# EAGLE design audioRev5 (EAGLE 9.7.0)
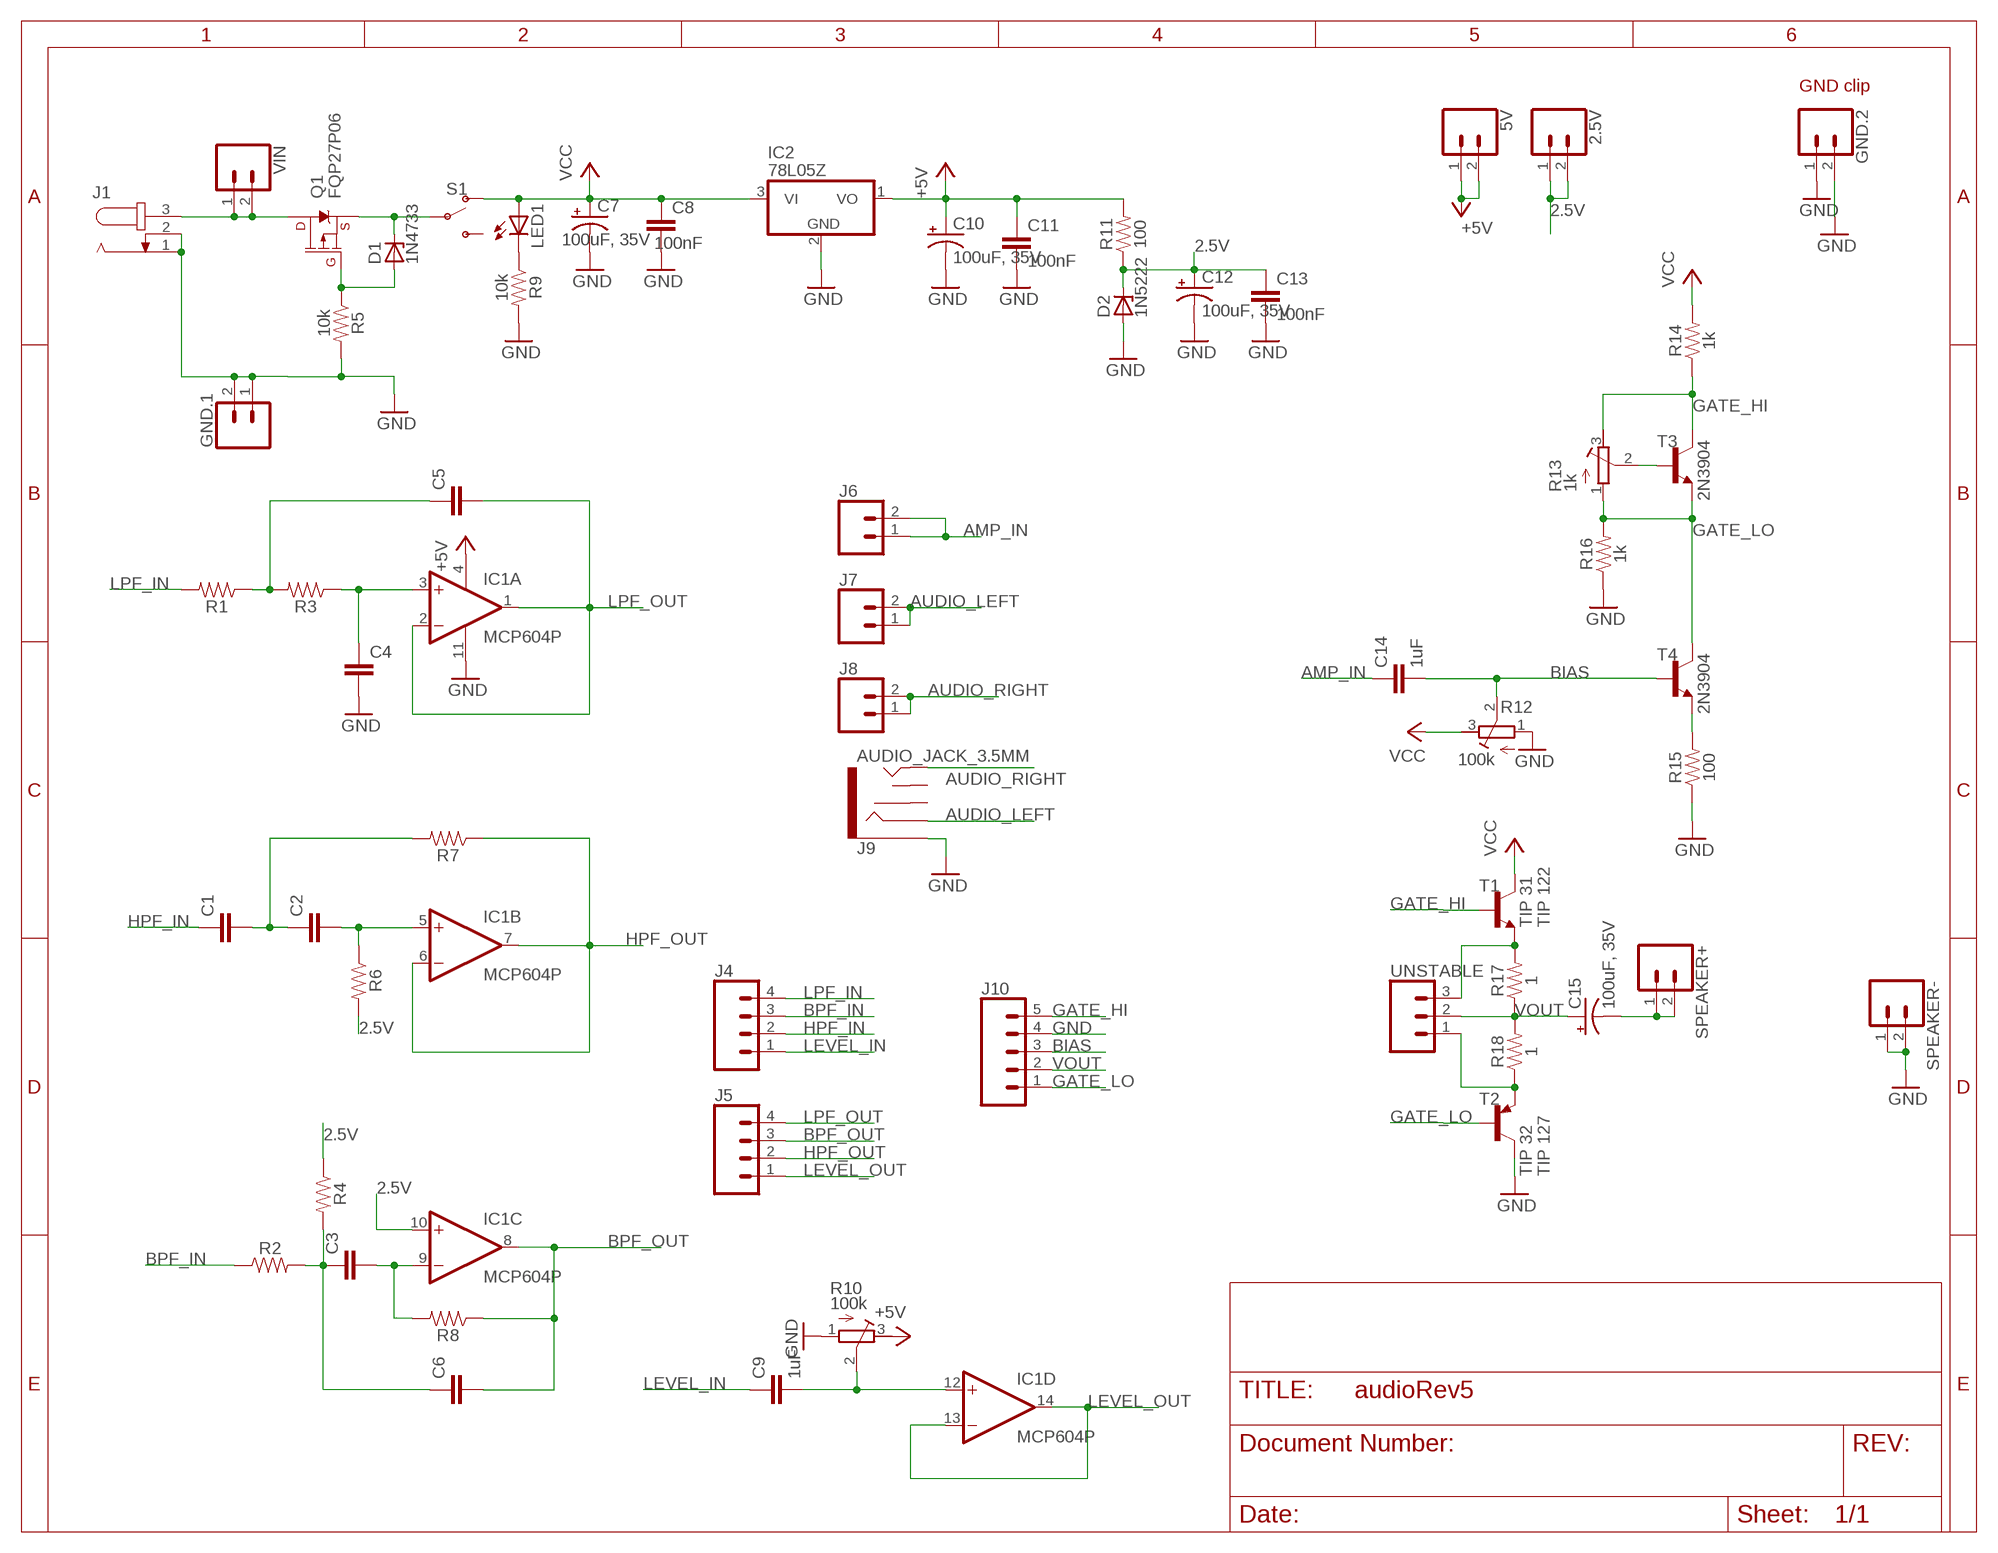
[diagram p0: schematic, sheet 1]

## Parts
2.5V  CONN_02  [1X02]
5V  CONN_02  [1X02]
C1  C-EU025-025X050  [C025-025X050]
C2  C-EU025-025X050  [C025-025X050]
C3  C-EU025-025X050  [C025-025X050]
C4  C-EU025-025X050  [C025-025X050]
C5  C-EU025-025X050  [C025-025X050]
C6  C-EU025-025X050  [C025-025X050]
C7  100uF, 35V  CPOL-USE2.5-6  [E2,5-6]
C8  100nF  C-EU025-025X050  [C025-025X050]
C9  1uF  C-EU025-025X050  [C025-025X050]
C10  100uF, 35V  CPOL-USE2.5-6  [E2,5-6]
C11  100nF  C-EU025-025X050  [C025-025X050]
C12  100uF, 35V  CPOL-USE2.5-6  [E2,5-6]
C13  100nF  C-EU025-025X050  [C025-025X050]
C14  1uF  C-EU025-025X050  [C025-025X050]
C15  100uF, 35V  CPOL-USE2.5-6  [E2,5-6]
D1  1N4733  ZENER-DIODEDO41Z10  [DO41Z10]
D2  1N5222  ZENER-DIODEDO34-7  [DO34Z7]
GND.1  CONN_02  [1X02]
GND.2  CONN_02  [1X02]
IC1  MCP604P  [DIL14]
IC2  78L05Z  [TO92]
J1  JACK-PLUG0  [SPC4077]
J4  CONN_04LOCK_LONGPADS  [1X04_LOCK_LONGPADS]
J5  CONN_04LOCK_LONGPADS  [1X04_LOCK_LONGPADS]
J6  CONN_02  [1X02]
J7  CONN_02  [1X02]
J8  CONN_02  [1X02]
J9  AUDIO_JACK_3.5MM  AUDIO_JACK_3.5MM_PTH  [AUDIO-JACK]
J10  CONN_05PTH_LONGPADS  [1X05_LONGPADS]
LED1  LED5MM  [LED5MM]
Q1  FQP27P06  MOSFET_PCH-NDP6020P  [TO220V]
R1  RESISTORAXIAL-0.3  [AXIAL-0.3]
R2  RESISTORAXIAL-0.3  [AXIAL-0.3]
R3  RESISTORAXIAL-0.3  [AXIAL-0.3]
R4  RESISTORAXIAL-0.3  [AXIAL-0.3]
R5  10k  RESISTORAXIAL-0.3  [AXIAL-0.3]
R6  RESISTORAXIAL-0.3  [AXIAL-0.3]
R7  RESISTORAXIAL-0.3  [AXIAL-0.3]
R8  RESISTORAXIAL-0.3  [AXIAL-0.3]
R9  10k  RESISTORAXIAL-0.3  [AXIAL-0.3]
R10  100k  R-TRIMM3296W  [RTRIM3296W]
R11  100  RESISTORAXIAL-0.3  [AXIAL-0.3]
R12  100k  R-TRIMM3296W  [RTRIM3296W]
R13  1k  R-TRIMM3296W  [RTRIM3296W]
R14  1k  RESISTORAXIAL-0.3  [AXIAL-0.3]
R15  100  RESISTORAXIAL-0.3  [AXIAL-0.3]
R16  1k  RESISTORAXIAL-0.3  [AXIAL-0.3]
R17  1  RESISTORAXIAL-0.3  [AXIAL-0.3]
R18  1  RESISTORAXIAL-0.3  [AXIAL-0.3]
S1  SWITCH-SPDT-PTH-11.6X4.0MM  [SWITCH_SPDT_PTH_11.6X4.0MM]
SPEAKER+  CONN_02  [1X02]
SPEAKER-  CONN_02  [1X02]
T1  TIP 31  -NPN-TO220V  [TO220V]
T2  TIP 32  -PNP-TO220V  [TO220V]
T3  2N3904  -NPN-TO92-EBC  [TO92-EBC]
T4  2N3904  -NPN-TO92-EBC  [TO92-EBC]
UNSTABLE  CONN_03LOCK_LONGPADS  [1X03_LOCK_LONGPADS]
VIN  CONN_02  [1X02]

## Nets
2.5V: 2.5V.1 2.5V.2 C12.+ C13.1 D2.C IC1.10(C:+IN) R4.P$1 R6.P$2 R11.P$1
+5V: 5V.1 5V.2 C10.+ C11.1 IC1.4(P:V+) IC2.1(VO) R10.3(E) R11.P$2
AMP_IN: C14.1 J6.1 J6.2
AUDIO_LEFT: J7.1 J7.2 J9.RING
AUDIO_RIGHT: J8.1 J8.2 J9.TIP
BIAS: C14.2 J10.3 R12.2(S) T4.B
BPF_IN: J4.3 R2.P$1
BPF_OUT: C6.2 IC1.8(C:OUT) J5.3 R8.P$1
DRAIN: J1.3 Q1.2(D) VIN.1 VIN.2
GATE: D1.A Q1.1(G) R5.P$1
GATE_HI: J10.5 R13.3(E) R14.P$1 T1.1(B) T3.C
GATE_LO: J10.1 R13.1(A) R16.P$2 T2.1(B) T3.E T4.C
GND: C4.2 C7.- C8.2 C10.- C11.2 C12.- C13.2 D2.A GND.1.1 GND.1.2 GND.2.1 GND.2.2 IC1.11(P:V-) IC2.2(GND) J1.1 J1.2 J9.SLEEVE J10.4 R5.P$2 R9.P$2 R10.1(A) R12.1(A) R15.P$1 R16.P$1 SPEAKER-.1 SPEAKER-.2 T2.2(C)
HPF_IN: C1.1 J4.2
HPF_OUT: IC1.6(B:-IN) IC1.7(B:OUT) J5.2 R7.P$1
LEVEL_IN: C9.1 J4.1
LEVEL_OUT: IC1.13(D:-IN) IC1.14(D:OUT) J5.1
LPF_IN: J4.4 R1.P$2
LPF_OUT: C5.2 IC1.1(A:OUT) IC1.2(A:-IN) J5.4
N$1: R18.P$1 T2.3(E) UNSTABLE.1
N$2: R17.P$2 T1.3(E) UNSTABLE.3
N$3: R15.P$2 T4.E
N$6: C3.1 C6.1 R2.P$2 R4.P$2
N$9: C4.1 IC1.3(A:+IN) R3.P$1
N$10: C5.1 R1.P$1 R3.P$2
N$11: C3.2 IC1.9(C:-IN) R8.P$2
N$12: C2.2 IC1.5(B:+IN) R6.P$1
N$13: C1.2 C2.1 R7.P$2
N$14: C9.2 IC1.12(D:+IN) R10.2(S)
N$16: C15.- SPEAKER+.1 SPEAKER+.2
N$18: LED1.K(C) R9.P$1
N$19: R13.2(S) T3.B
SOURCE: D1.C Q1.3(S) S1.2(P)
VCC: C7.+ C8.1 IC2.3(VI) LED1.A R12.3(E) R14.P$2 S1.1(O) T1.2(C)
VOUT: C15.+ J10.2 R17.P$1 R18.P$2 UNSTABLE.2
Unconnected: J9.RSH J9.TSH S1.3(S)

## Notes on the sheet
- GND clip
- TIP 122
- TIP 127

## Library data of the parts
2.5V 5V GND.1 GND.2 J6-J8 SPEAKER+ SPEAKER- VIN = SparkFun-Connectors:CONN_02: Multi connection point. Often used as Generic Header-pin footprint for 0.1 inch spaced/style header connections On any of the 0.1 inch spaced packages, you can populate with these: Break Away Headers - Straight <https://www.sparkfun.com/products/116> (PRT-00116) Break Away Male Headers - Right Angle <https://www.sparkfun.com/products/553> (PRT-00553) Female Headers <https://www.sparkfun.com/products/115> (PRT-00115) Break Away Headers - Machine Pin <https://www.sparkfun.com/products/117> (PRT-00117) Break Away Female Headers - Swiss Machine Pin <https://www.sparkfun.com/products/743> (PRT-00743) For SCREWTERMINALS and SPRING TERMINALS visit here: Screw Terimnals on SparkFun.com <https://www.sparkfun.com/search/results?term=Screw+Terminals> (5mm/3.5mm/2.54mm spacing) This device is also useful as a general connection point to wire up your design to another part of your project. Our various solder wires solder well into these plated through hole pads. Hook-Up Wire - Assortment (Stranded, 22 AWG) <https://www.sparkfun.com/products/11375> (PRT-11375) Hook-Up Wire - Assortment (Solid Core, 22 AWG) <https://www.sparkfun.com/products/11367> (PRT-11367) View the entire wire category on our website here <https://www.sparkfun.com/categories/141> Special notes: Molex polarized connector foot print use with: PRT-08233 with associated crimp pins and housings. 2.54_SCREWTERM for use with PRT-10571. 3.5mm Screw Terminal footprints for PRT-08084 5mm Screw Terminal footprints for use with PRT-08432
C1-C6 C8 C9 C11 C13 C14 = rcl:C-EU: CAPACITOR, European symbol
C7 C10 C12 C15 = rcl:CPOL-US: POLARIZED CAPACITOR, American symbol
D1 D2 = diode:ZENER-DIODE: Z-Diode
IC1 = linear:MCP604: Quad Op Amp 2.7V to 6.0V Single Supply CMOS Source: http://ww1.microchip.com/downloads/en/DeviceDoc/21314g.pdf
IC2 = linear:78*: Positive VOLTAGE REGULATOR Source: http://cache.national.com/ds/LM/LM78L05.pdf http://www.fairchildsemi.com/ds/LM/LM7805.pdf
J1 = con-jack:JACK-PLUG: DC POWER JACK Power Jack, DC, Right Angle, Through Hole, Rated 5A at 16VDC, PC Terminals Distributor: Farnell (www.Farnell.de) Drawing: 84N1161.pdf / 84N1162.pdf Manufacturer: SPC Technology (www.spctechnology.com) Type: SPC4077 / SPC 4078
J4 J5 = SparkFun-Connectors:CONN_04: Multi connection point. Often used as Generic Header-pin footprint for 0.1 inch spaced/style header connections On any of the 0.1 inch spaced packages, you can populate with these: Break Away Headers - Straight <https://www.sparkfun.com/products/116> (PRT-00116) Break Away Male Headers - Right Angle <https://www.sparkfun.com/products/553> (PRT-00553) Female Headers <https://www.sparkfun.com/products/115> (PRT-00115) Break Away Headers - Machine Pin <https://www.sparkfun.com/products/117> (PRT-00117) Break Away Female Headers - Swiss Machine Pin <https://www.sparkfun.com/products/743> (PRT-00743) For SCREWTERMINALS and SPRING TERMINALS visit here: Screw Terimnals on SparkFun.com <https://www.sparkfun.com/search/results?term=Screw+Terminals> (5mm/3.5mm/2.54mm spacing) This device is also useful as a general connection point to wire up your design to another part of your project. Our various solder wires solder well into these plated through hole pads. Hook-Up Wire - Assortment (Stranded, 22 AWG) <https://www.sparkfun.com/products/11375> (PRT-11375) Hook-Up Wire - Assortment (Solid Core, 22 AWG) <https://www.sparkfun.com/products/11367> (PRT-11367) View the entire wire category on our website here <https://www.sparkfun.com/categories/141> Special notes: Molex polarized connector foot print use with SKU : PRT-08231 with associated crimp pins and housings. 1MM SMD Version SKU: PRT-10208
J9 = SparkFun-Connectors:AUDIO_JACK_3.5MM: Audio Jack 3.5mm variants of PTH and SMT stereo audio jack with bypass switches. SparkFun Products: SparkFun SparkPunk Sound Kit <[https://www.sparkfun.com/products/11177]> - PTH MP3 Trigger <https://www.sparkfun.com/products/13720> -3.5mm SMD SparkFun PicoBoard <https://www.sparkfun.com/products/11888>- 2.5mm SMD
J10 = SparkFun-Connectors:CONN_05: Multi connection point. Often used as Generic Header-pin footprint for 0.1 inch spaced/style header connections On any of the 0.1 inch spaced packages, you can populate with these: Break Away Headers - Straight <https://www.sparkfun.com/products/116> (PRT-00116) Break Away Male Headers - Right Angle <https://www.sparkfun.com/products/553> (PRT-00553) Female Headers <https://www.sparkfun.com/products/115> (PRT-00115) Break Away Headers - Machine Pin <https://www.sparkfun.com/products/117> (PRT-00117) Break Away Female Headers - Swiss Machine Pin <https://www.sparkfun.com/products/743> (PRT-00743) For SCREWTERMINALS and SPRING TERMINALS visit here: Screw Terimnals on SparkFun.com <https://www.sparkfun.com/search/results?term=Screw+Terminals> (5mm/3.5mm/2.54mm spacing) This device is also useful as a general connection point to wire up your design to another part of your project. Our various solder wires solder well into these plated through hole pads. Hook-Up Wire - Assortment (Stranded, 22 AWG) <https://www.sparkfun.com/products/11375> (PRT-11375) Hook-Up Wire - Assortment (Solid Core, 22 AWG) <https://www.sparkfun.com/products/11367> (PRT-11367) View the entire wire category on our website here <https://www.sparkfun.com/categories/141> Special notes: Molex polarized connector foot print use with SKU : PRT-08231 with associated crimp pins and housings. 1MM SMD Version SKU: PRT-10208
LED1 = led:LED: LED OSRAM: - CHIPLED LG R971, LG N971, LY N971, LG Q971, LY Q971, LO R971, LY R971 LH N974, LH R974 LS Q976, LO Q976, LY Q976 LO Q996 - Hyper CHIPLED LW Q18S LB Q993, LB Q99A, LB R99A - SideLED LS A670, LO A670, LY A670, LG A670, LP A670 LB A673, LV A673, LT A673, LW A673 LH A674 LY A675 LS A676, LA A676, LO A676, LY A676, LW A676 LS A679, LY A679, LG A679 - Hyper Micro SIDELED® LS Y876, LA Y876, LO Y876, LY Y876 LT Y87S - SmartLED LW L88C, LW L88S LB L89C, LB L89S, LG L890 LS L89K, LO L89K, LY L89K LS L896, LA L896, LO L896, LY L896 - TOPLED LS T670, LO T670, LY T670, LG T670, LP T670 LSG T670, LSP T670, LSY T670, LOP T670, LYG T670 LG T671, LOG T671, LSG T671 LB T673, LV T673, LT T673, LW T673 LH T674 LS T676, LA T676, LO T676, LY T676, LB T676, LH T676, LSB T676, LW T676 LB T67C, LV T67C, LT T67C, LS T67K, LO T67K, LY T67K, LW E67C LS E67B, LA E67B, LO E67B, LY E67B, LB E67C, LV E67C, LT E67C LW T67C LS T679, LY T679, LG T679 LS T770, LO T770, LY T770, LG T770, LP T770 LB T773, LV T773, LT T773, LW T773 LH T774 LS E675, LA E675, LY E675, LS T675 LS T776, LA T776, LO T776, LY T776, LB T776 LHGB T686 LT T68C, LB T68C - Hyper Mini TOPLED® LB M676 - Mini TOPLED Santana® LG M470 LS M47K, LO M47K, LY M47K Source: http://www.osram.convergy.de LUXEON: - LUMILED® LXK2-PW12-R00, LXK2-PW12-S00, LXK2-PW14-U00, LXK2-PW14-V00 LXK2-PM12-R00, LXK2-PM12-S00, LXK2-PM14-U00 LXK2-PE12-Q00, LXK2-PE12-R00, LXK2-PE12-S00, LXK2-PE14-T00, LXK2-PE14-U00 LXK2-PB12-K00, LXK2-PB12-L00, LXK2-PB12-M00, LXK2-PB14-N00, LXK2-PB14-P00, LXK2-PB14-Q00 LXK2-PR12-L00, LXK2-PR12-M00, LXK2-PR14-Q00, LXK2-PR14-R00 LXK2-PD12-Q00, LXK2-PD12-R00, LXK2-PD12-S00 LXK2-PH12-R00, LXK2-PH12-S00 LXK2-PL12-P00, LXK2-PL12-Q00, LXK2-PL12-R00 Source: www.luxeon.com KINGBRIGHT: KA-3528ASYC Source: www.kingbright.com
Q1 = SparkFun-DiscreteSemi:MOSFET_PCH: P-channel MOSFETs Voltage controlled devices that allow control of high current outputs. SparkFun Products: SparkFun ESP32 Thing <https://www.sparkfun.com/products/13907> SparkFun ESP8266 Thing <https://www.sparkfun.com/products/13231> SparkFun Pi Servo HAT V2 <https://www.sparkfun.com/products/15316> DMG2305UX-7 (20V/4.2A/SOT23-3)
R1-R9 R11 R14-R18 = SparkFun-Resistors:RESISTOR: Generic Resistor Package
R10 R12 R13 = rcl:R-TRIMM: Trimm resistor
S1 = SparkFun-Switches:SWITCH-SPDT: Single Pole, Double Throw (SPDT) Switch Single-pole, double-throw (SPDT) switch. Variant Overview SMD-AYZ0202 Surface Mount DPDT Switch <https://www.sparkfun.com/products/597> (COM-00597) Used on e.g. LilyPad Arduino USB - ATmega32U4 Board <https://www.sparkfun.com/products/12049> PTH-11.6X4.0MM SPDT Mini Power Switch <https://www.sparkfun.com/products/102> (COM-00102) Used on e.g. SparkFun Simon Says - Through-Hole Soldering Kit <https://www.sparkfun.com/products/10547> (KIT-10547) PTH-11.6X4.0MM-KIT KIT version of SPDT Mini Power Switch - Simplifies soldering by removing tStop of switch pins - only one side can be soldered. PTH-11.6X4.0MM-LOCK LOCK version of SPDT Mini Power Switch - Offset pins hold switch in place for easier soldering. SMD-RIGHT-ANGLE Surface Mount Right Angle Switch <https://www.sparkfun.com/products/10860> (COM-10860) Used on e.g. SparkFun ESP8266 Thing <https://www.sparkfun.com/products/13231>
T1 T3 T4 = transistor:*-NPN-: NPN Transistror BF959 corrected 2008.03.06
T2 = transistor:*-PNP-: PNP Transistror
UNSTABLE = SparkFun-Connectors:CONN_03: Multi connection point. Often used as Generic Header-pin footprint for 0.1 inch spaced/style header connections On any of the 0.1 inch spaced packages, you can populate with these: Break Away Headers - Straight <https://www.sparkfun.com/products/116> (PRT-00116) Break Away Male Headers - Right Angle <https://www.sparkfun.com/products/553> (PRT-00553) Female Headers <https://www.sparkfun.com/products/115> (PRT-00115) Break Away Headers - Machine Pin <https://www.sparkfun.com/products/117> (PRT-00117) Break Away Female Headers - Swiss Machine Pin <https://www.sparkfun.com/products/743> (PRT-00743) Stackable Header - 3 Pin (Female, 0.1") <https://www.sparkfun.com/products/13875> (PRT-13875) For SCREWTERMINALS and SPRING TERMINALS visit here: Screw Terimnals on SparkFun.com <https://www.sparkfun.com/search/results?term=Screw+Terminals> (5mm/3.5mm/2.54mm spacing) This device is also useful as a general connection point to wire up your design to another part of your project. Our various solder wires solder well into these plated through hole pads. Hook-Up Wire - Assortment (Stranded, 22 AWG) <https://www.sparkfun.com/products/11375> (PRT-11375) Hook-Up Wire - Assortment (Solid Core, 22 AWG) <https://www.sparkfun.com/products/11367> (PRT-11367) View the entire wire category on our website here <https://www.sparkfun.com/categories/141> Special notes: Molex polarized connector foot print use with SKU : PRT-08232 with associated crimp pins and housings.

## Board
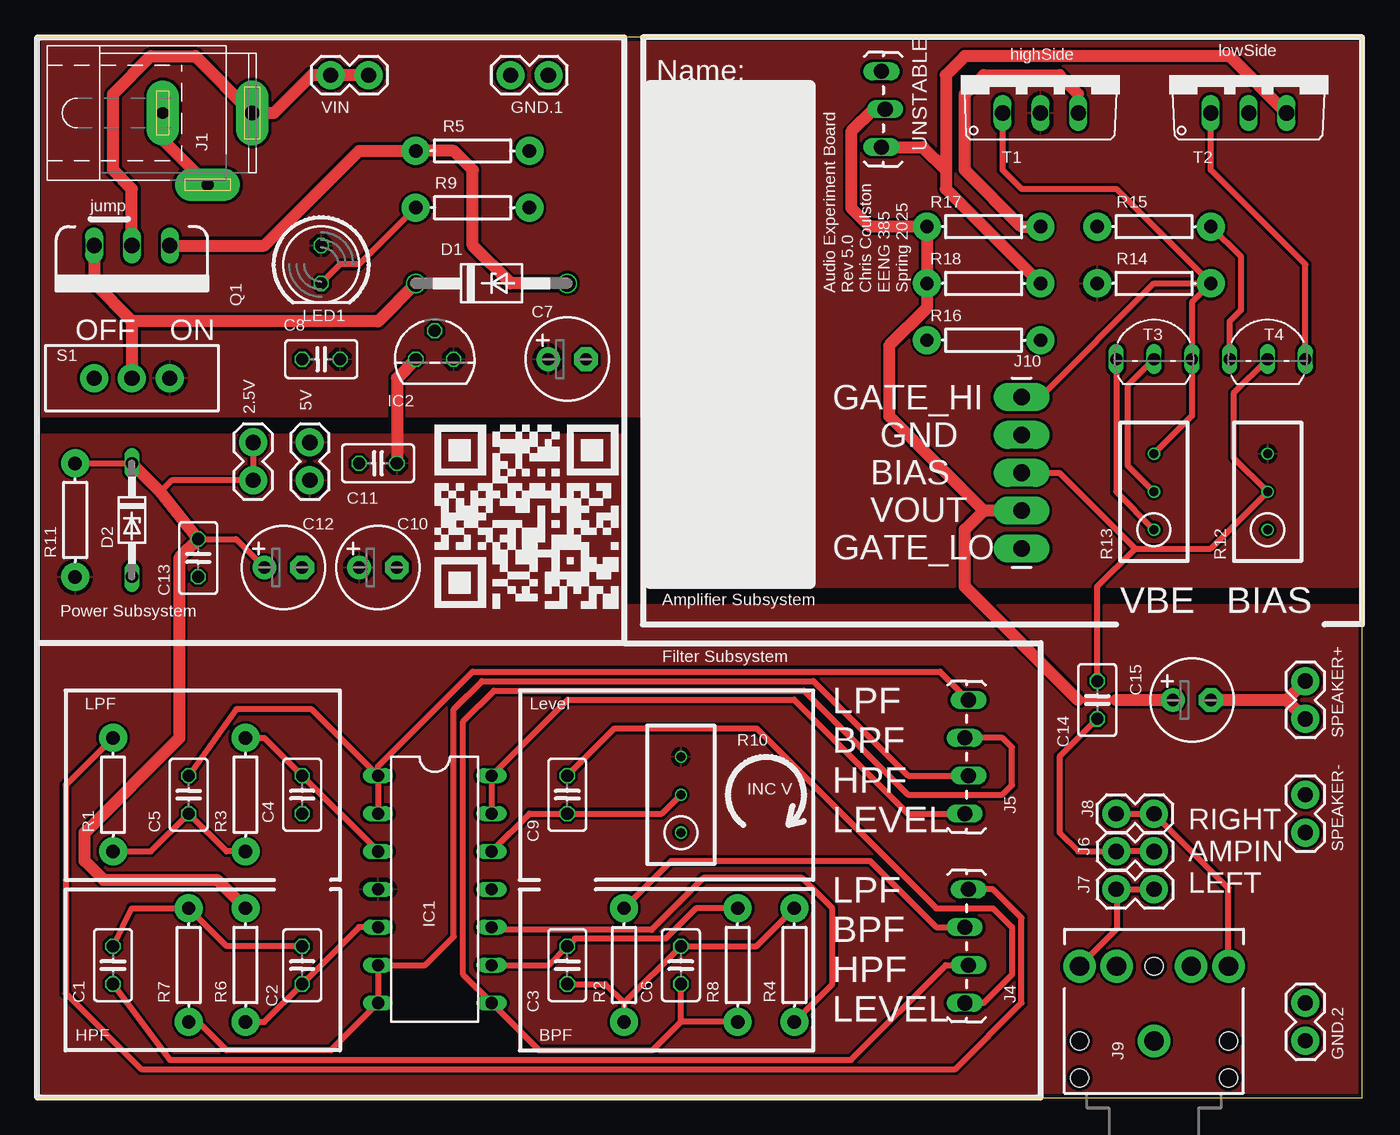
[diagram p1: board, top side]
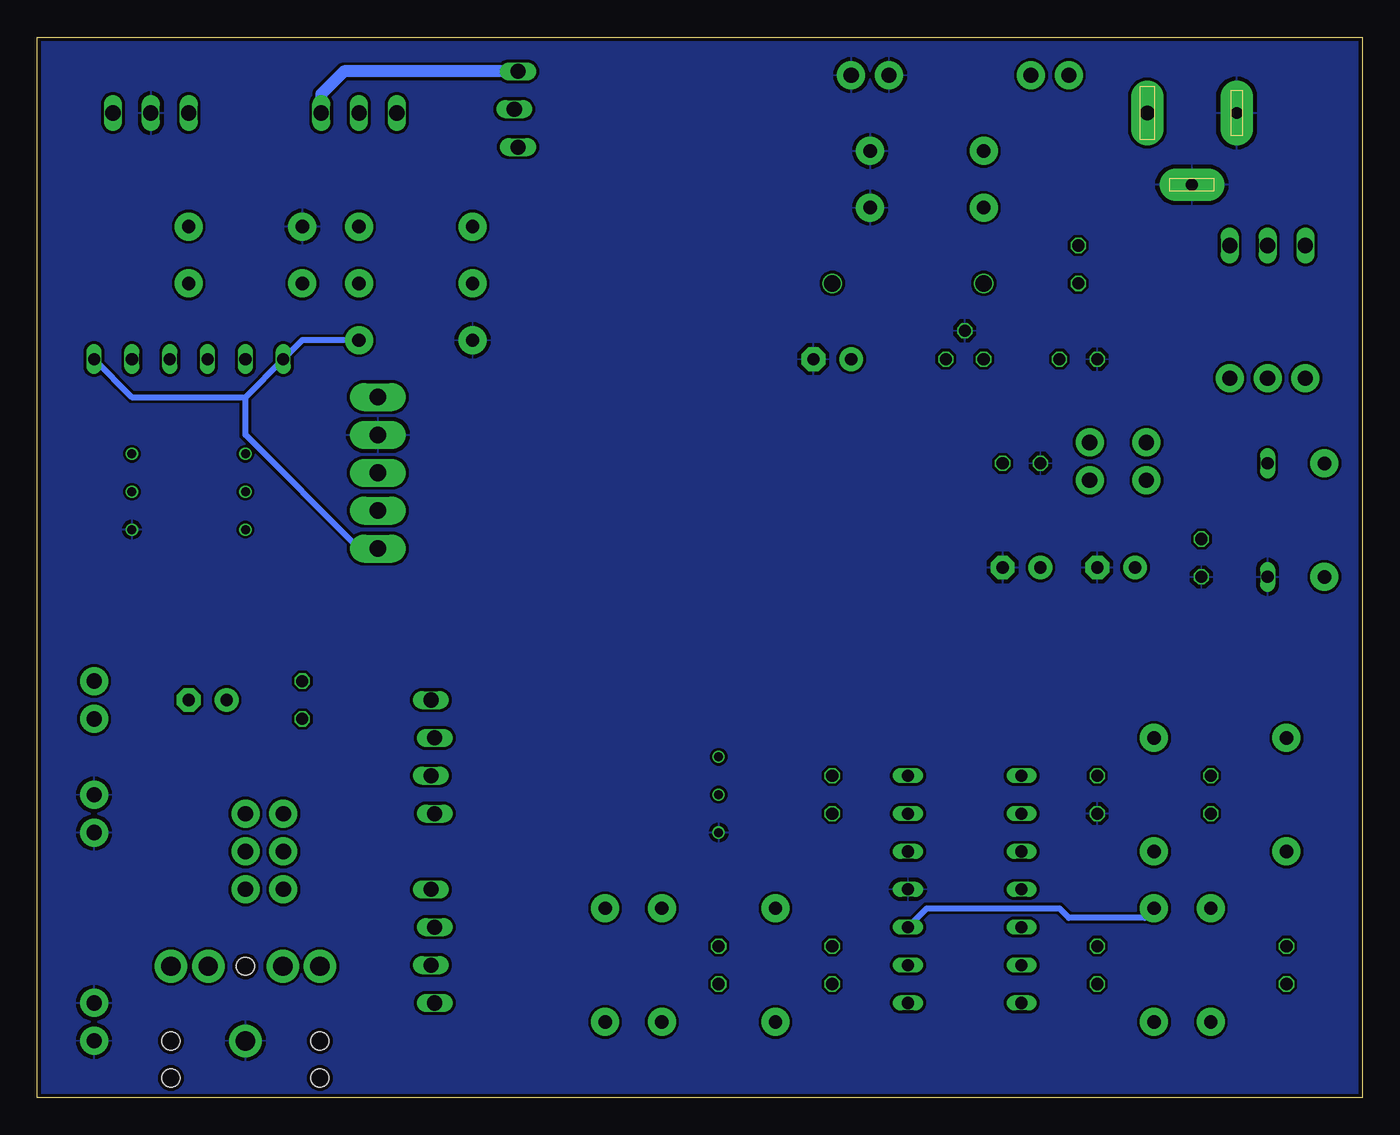
[diagram p2: board, bottom side, seen from below]

Size 88.9 x 71.12 mm. Coordinates in mm from the lower left corner, seen from the top.
Outline: 0,0 88.9,0 88.9,71.12 0,71.12 0,0
Copper layers (1*16): Top / Bottom
Stack-up Default Layer Stack: Top User Defined 0.0356mm / Dielectric-1 User Defined 1.5011mm / Bottom User Defined 0.0356mm
Design rules: minimum copper width 7mil, minimum drill size 10mil, copper clearance wire_polygon to wire_polygon 7mil, copper clearance wire_polygon to pad_smd 7mil, copper clearance wire_polygon to via 7mil, copper clearance pad_smd to pad_smd 7mil, copper clearance pad_smd to via 7mil, copper clearance via to via 7mil, copper clearance smd to pad (same net) 0mil, copper clearance smd to via (same net) 0mil, copper clearance smd to smd (same net) 0mil, dimension clearance 10mil, via restrict clearance 0mil, restrict clearance 0mil, drill distance 10mil, keepout clearance 0mil

### Footprints (pad centres in the part's own frame; a part is rotated, then mirrored left to right if it is on the bottom)
1X02 = drill 1.016 pad 1.88: 1 0,0; 2 2.54,0
C025-025X050 = drill 0.813 octagon: 1 -1.27,0; 2 1.27,0
E2,5-6 = drill 0.813 pad 1.6: + -1.27,0 | drill 0.813 pad 1.6 octagon: - 1.27,0
DO41Z10 = drill 1.118: A 5.08,0; C -5.08,0
DO34Z7 = drill 0.813 long: A 3.81,0; C -3.81,0
DIL14 = drill 0.813 long: 1 -7.62,-3.81; 2 -5.08,-3.81; 3 -2.54,-3.81; 4 0,-3.81; 5 2.54,-3.81; 6 5.08,-3.81; 7 7.62,-3.81; 8 7.62,3.81; 9 5.08,3.81; 10 2.54,3.81; 11 0,3.81; 12 -2.54,3.81; 13 -5.08,3.81; 14 -7.62,3.81
TO92 = drill 0.813 octagon: 1 -1.27,0; 2 0,1.905; 3 1.27,0
SPC4077 = drill 0.8 pad 2.184 long: 1 -3,0; 2 0,-4.8 | drill 1 pad 2.184 long: 3 3,0
1X04_LOCK_LONGPADS = drill 1.016 long: 1 0,0; 2 2.54,-0.254; 3 5.08,0; 4 7.62,-0.254
AUDIO-JACK = drill 1.3 pad 2.184: RING 5,5; RSH 5,2.5; SLEEVE 0,0; TIP 5,-5; TSH 5,-2.5 | hole 1.2: 0,5; -2.5,5; -2.5,-5; 0,-5; 5,0
1X05_LONGPADS = drill 1.118 pad 1.88 long: 1 0,0; 2 2.54,0; 3 5.08,0; 4 7.62,0; 5 10.16,0
LED5MM = drill 0.813 octagon: A -1.27,0; K 1.27,0
TO220V = drill 1.016 long: 1 -2.54,0; 2 0,0; 3 2.54,0
AXIAL-0.3 = drill 0.9 pad 1.88: P$1 -3.81,0; P$2 3.81,0
RTRIM3296W = drill 0.61: 1 0,-2.54; 2 0,0; 3 0,2.54
SWITCH_SPDT_PTH_11.6X4.0MM = drill 1.016 pad 1.88: 1 0,2.54; 2 0,0; 3 0,-2.54
TO220V' = drill 1.016 long: 1 -2.54,-2.54; 2 0,-2.54; 3 2.54,-2.54
TO92-EBC = drill 0.813 long: B 0,-1.27; C 2.54,-1.27; E -2.54,-1.27
1X03_LOCK_LONGPADS = drill 1.016 long: 1 0,0; 2 2.54,-0.254; 3 5.08,0

### Placement (x,y rotation side)
2.5V  14.48,41.4 90 top
5V  18.29,41.4 90 top
C1  5.08,8.89 90 top
C2  17.78,8.89 270 top
C3  35.56,8.89 90 top
C4  17.78,20.32 270 top
C5  10.16,20.32 90 top
C6  43.18,8.89 270 top
C7  35.56,49.53 0 top
C8  19.05,49.53 180 top
C9  35.56,20.32 270 top
C10  22.86,35.56 0 top
C11  22.86,42.55 180 top
C12  16.51,35.56 0 top
C13  10.79,36.2 270 top
C14  71.12,26.67 90 top
C15  77.47,26.67 0 top
D1  30.48,54.61 0 top
D2  6.35,38.73 270 top
GND.1  34.29,68.58 180 top
GND.2  85.09,6.35 270 top
IC1  26.67,13.97 270 top
IC2  26.67,49.53 0 top
J1  11.43,66.04 0 top
J4  62.23,6.35 90 top
J5  62.23,19.05 90 top
J6  72.39,16.51 0 top
J7  72.39,13.97 0 top
J8  74.93,19.05 180 top
J9  74.93,3.81 90 top
J10  66.04,36.83 90 top
LED1  19.05,55.88 270 top
Q1  6.35,57.15 180 top
R1  5.08,20.32 90 top
R2  39.37,8.89 270 top
R3  13.97,20.32 270 top
R4  50.8,8.89 90 top
R5  29.21,63.5 0 top
R6  13.97,8.89 90 top
R7  10.16,8.89 90 top
R8  46.99,8.89 90 top
R9  29.21,59.69 0 top
R10  43.18,20.32 0 top
R11  2.54,38.73 270 top
R12  82.55,40.64 0 top
R13  74.93,40.64 0 top
R14  74.93,54.61 180 top
R15  74.93,58.42 0 top
R16  63.5,50.8 0 top
R17  63.5,58.42 0 top
R18  63.5,54.61 180 top
S1  6.35,48.26 270 top
SPEAKER+  85.09,27.94 270 top
SPEAKER-  85.09,17.78 90 top
T1  TIP 31  [TO220V']  67.31,68.58 0 top
T2  TIP 32  [TO220V']  81.28,68.58 0 top
T3  74.93,50.8 0 top
T4  82.55,50.8 0 top
UNSTABLE  56.64,63.75 90 top
VIN  22.23,68.58 180 top

### Tracks (layer width: path | path; a pad name or v marks a point on that pad's centre or on a via)
2.5V
  Top 0.406: R11.P$1 D2.C | C13.1 13.34,37.47 C12.+ | R4.P$1 53.34,7.62 53.34,12.7 51.31,14.73 44.7,14.73 41.22,11.25 30.66,11.25 IC1.10 | 8.26,40.64 9.02,41.4 2.5V.1 2.5V.2
  Top 0.813: R6.P$2 12.06,14.61 4.45,14.61 3.17,15.88 3.17,17.78 9.53,24.13 9.53,36.2 C13.1 8.26,40.64 D2.C
  Bottom 0.406: IC1.10 29.21,12.7 20.32,12.7 19.68,12.06 14.61,12.06 R6.P$2
+5V
  Top 0.813: IC2.1 24.13,48.26 C11.1
  pour Top: 88.98,33.1 39.45,33.1 39.45,44.53 -0.08,44.53 -0.08,-0.08 88.98,-0.08
AMP_IN
  Top 0.406: J6.2 J6.1 69.85,16.51 68.58,17.78 68.58,22.86 C14.1
AUDIO_LEFT
  Top 0.406: J7.2 J7.1 72.47,13.89 72.47,11.35 J9.RING
AUDIO_RIGHT
  Top 0.406: J9.TIP 79.93,14.05 J8.1 J8.2
BIAS
  Top 0.406: T4.B 80.26,47.24 80.26,42.93 R12.2 78.74,36.83 73.66,36.83 | J10.3 68.58,41.91 73.66,36.83 | C14.2 71.12,34.29 73.66,36.83
BPF_IN
  Top 0.406: R2.P$1 42.55,15.88 55.88,15.88 60.33,11.43 J4.3
BPF_OUT
  Top 0.406: J5.3 64.77,24.13 65.41,23.5 65.41,20.95 64.77,20.32 58.42,20.32 51.44,27.3 30.64,27.3 28.57,25.25 28.57,8.26 IC1.8 33.66,3.17 41.27,3.17 43.18,5.08 | 43.18,5.08 C6.2 | R8.P$1 43.18,5.08
DRAIN
  Top 0.813: VIN.1 VIN.2 18.41,68.58 16.51,66.67 15.88,66.04 J1.3 10.62,69.85 7.62,69.85 5.08,67.31 5.08,62.23 6.35,60.96 Q1.2
GATE
  Top 0.813: Q1.1 15.24,57.15 21.59,63.5 R5.P$1 27.94,63.5 29.21,62.23 29.21,57.15 31.75,54.61 D1.A
GATE_HI
  Top 0.406: R13.3 77.47,45.72 T3.C 77.47,53.34 R14.P$1 | R14.P$1 74.93,54.61 67.31,46.99 J10.5 | T1.1 64.77,62.23 66.04,60.96 72.39,60.96 R14.P$1
GATE_LO
  Top 0.406: T3.E 72.39,40.64 R13.1 | T2.1 78.74,62.23 85.09,55.88 T4.C
  Bottom 0.406: T4.C 82.55,46.99 74.93,46.99 | 74.93,46.99 T3.E 71.12,50.8 R16.P$2 | J10.1 67.31,36.83 74.93,44.45 74.93,46.99
GND
  Top 0.813: J1.1 8.43,64.24 J1.2
  pour Bottom: 88.98,71.2 -0.08,71.2 -0.08,-0.08 88.98,-0.08
HPF_IN
  Top 0.406: C1.1 8.89,2.54 54.61,2.54 60.96,8.89 J4.2
HPF_OUT
  Top 0.406: R7.P$1 10.79,5.08 12.7,3.17 19.68,3.17 IC1.7 IC1.6 26.04,8.89 27.94,10.79 27.94,26.04 29.84,27.94 52.07,27.94 58.42,21.59 J5.2
LEVEL_IN
  Top 0.406: J4.1 63.5,6.35 65.41,8.26 65.41,11.43 64.14,12.7 60.33,12.7 48.26,24.77 38.73,24.77 C9.1
LEVEL_OUT
  Top 0.406: IC1.13 IC1.14 35.59,26.7 50.77,26.7 58.42,19.05 J5.1
LPF_IN
  Top 0.406: J4.4 64.14,13.97 66.04,12.06 66.04,6.35 61.59,1.91 6.99,1.91 1.91,6.99 1.91,20.95 R1.P$2
LPF_OUT
  Top 0.406: IC1.1 IC1.2 | IC1.1 18.41,26.04 13.34,26.04 C5.2 | J5.4 60.58,28.57 29.21,28.57 22.86,22.23 IC1.1
N$1
  Top 0.813: T2.3 80.01,69.85 62.23,69.85 60.96,68.58 60.96,62.23 | 60.96,62.23 60.96,60.96 R18.P$1 | UNSTABLE.1 59.44,63.75 60.96,62.23
N$2
  Top 0.406: 69.85,67.31 T1.3
  Top 0.813: R17.P$2 66.04,58.42 62.23,62.23 62.23,67.31 63.5,68.58 68.58,68.58 69.85,67.31
  Bottom 0.813: UNSTABLE.3 68.33,68.83 69.85,67.31 T1.3
N$3
  Top 0.406: T4.E 80.01,52.07 80.77,52.83 80.77,56.39 R15.P$2
N$6
  Top 0.406: R4.P$2 48.26,10.16 C6.1 39.37,6.35 | 39.37,6.35 R2.P$2 | C3.1 38.1,7.62 39.37,6.35
N$9
  Top 0.406: R3.P$1 15.24,24.13 C4.1 IC1.3
N$10
  Top 0.406: R1.P$1 7.62,16.51 C5.1 12.7,16.51 R3.P$2
N$11
  Top 0.406: IC1.9 34.29,8.89 C3.2 36.07,10.67 42.16,10.67 44.2,12.7 R8.P$2
N$12
  Top 0.406: R6.P$1 15.24,5.08 C2.2 21.59,11.43 IC1.5
N$13
  Top 0.406: C2.1 16.51,10.16 12.7,10.16 R7.P$2 6.35,12.7 C1.2
N$14
  Top 0.406: IC1.12 33.02,19.05 C9.2 41.91,19.05 R10.2
N$16
  Top 0.813: SPEAKER+.1 83.82,26.67 | SPEAKER+.2 83.82,26.67 | 83.82,26.67 C15.-
N$18
  Top 0.406: R9.P$1 21.59,55.88 20.32,55.88 LED1.K
N$19
  Top 0.406: T3.B 73.15,47.75 73.15,42.42 R13.2
SOURCE
  Top 0.813: 6.35,52.07 S1.2 | Q1.3 3.81,54.61 6.35,52.07 | D1.C 22.86,52.07 6.35,52.07
VCC
  pour Top: 88.98,71.2 -0.08,71.2 -0.08,45.64 40.56,45.64 40.56,34.21 88.98,34.21
VOUT
  Top 0.406: 72.39,26.67 69.85,26.67
  Top 0.813: J10.2 63.5,39.37 | 63.5,39.37 57.15,45.72 57.15,50.41 59.69,52.95 R18.P$2 R17.P$1 55.88,58.42 54.61,59.69 54.61,64.77 56.13,66.29 UNSTABLE.2 | 63.5,39.37 62.23,38.1 62.23,34.29 69.85,26.67 | C15.+ 72.39,26.67

### Text on the board
tPlace: highSide | lowSide | Name: | jump | Audio Experiment Board / Rev 5.0 / Chris Coulston / EENG 385 / Spring 2025 | OFF ON | GATE_HI / GND / BIAS / VOUT / GATE_LO | Amplifier Subsystem | VBE BIAS | Power Subsystem | Filter Subsystem | LPF | Level | INC V | LPF / BPF / HPF / LEVEL | RIGHT / AMPIN / LEFT | LPF / BPF / HPF / LEVEL | HPF | BPF